# EasyEDA Pro project ESP32 Board.eprj

# Schematic Schematic_ESP32 Board
Board Name: Board1; Create Date: 2026-09-16; Page Name: P1; Project Name: ESP32 Board; Schematic Name: Schematic_ESP32 Board; Update Date: 2026-09-17; Company: EasyEDA.com; Page Size: A4; Version: V1.0
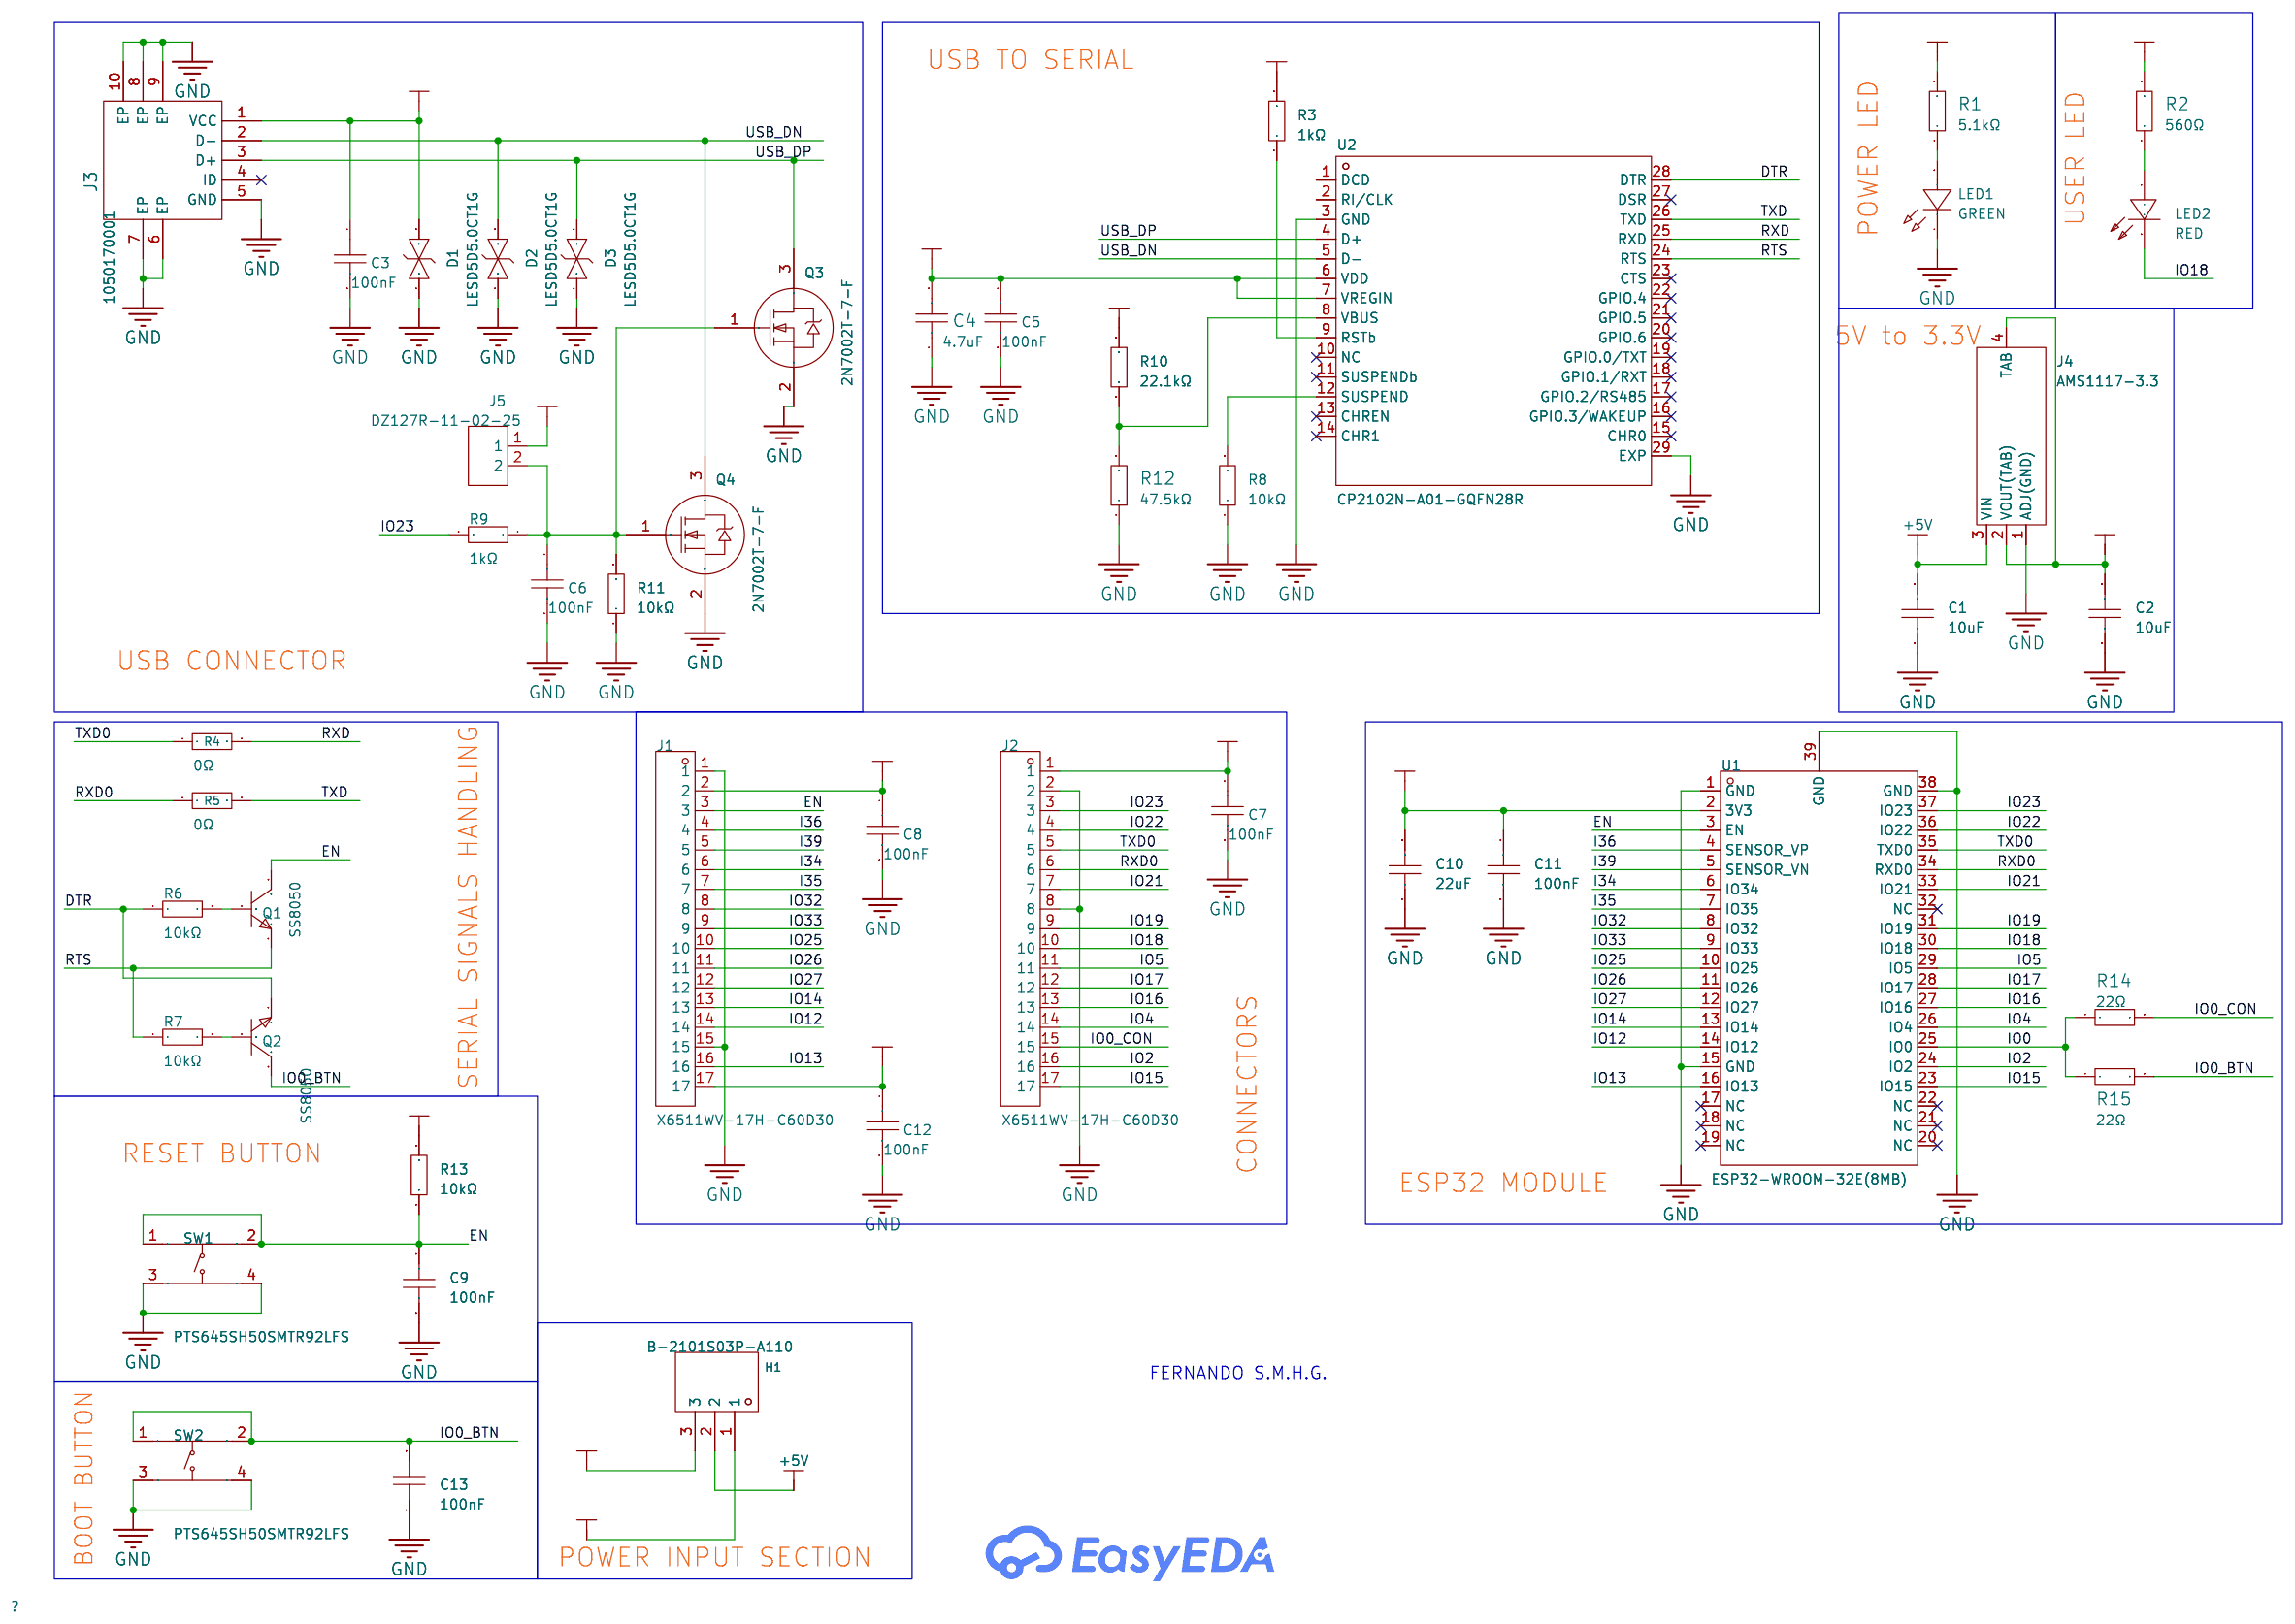
[diagram p0: schematic sheet]

## Parts
C1  10uF  [C0402]
C2  10uF  [C0402]
C3  100nF  [C0402]
C4  4.7uF  [C0402]
C5  100nF  [C0402]
C6  100nF  [C0402]
C7  100nF  [C0402]
C8  100nF  [C0402]
C9  100nF  [C0402]
C10  22uF  [C0805]
C11  100nF  [C0402]
C12  100nF  [C0402]
C13  100nF  [C0402]
D1  LESD5D5.0CT1G  [SOD-523_L1.2-W0.8-LS1.6-BI]
D2  LESD5D5.0CT1G  [SOD-523_L1.2-W0.8-LS1.6-BI]
D3  LESD5D5.0CT1G  [SOD-523_L1.2-W0.8-LS1.6-BI]
H1  B-2101S03P-A110  [HDR-TH_3P-P1.27-V-M-1]
J1  X6511WV-17H-C60D30  [HDR-TH_17P-P2.54-V-M]
J2  X6511WV-17H-C60D30  [HDR-TH_17P-P2.54-V-M]
J3  1050170001  [MICRO-USB-SMD_105017-0001]
J4  AMS1117-3.3  [SOT-223-4_L6.5-W3.5-P2.30-LS7.0-BR]
J5  DZ127R-11-02-25  [HDR-TH_2P-P1.27-V-M]
LED1  GREEN  [LED0805-RD]
LED2  RED  [LED0805-R-RD]
Q1  SS8050  [SOT-23-3_L2.9-W1.3-P1.90-LS2.4-BR]
Q2  SS8050  [SOT-23-3_L2.9-W1.3-P1.90-LS2.4-BR]
Q3  2N7002T-7-F  [SOT-523-3_L1.6-W0.8-P1.00-LS1.6-BR]
Q4  2N7002T-7-F  [SOT-523-3_L1.6-W0.8-P1.00-LS1.6-BR]
R1  5.1kΩ  [R0402]
R2  560Ω  [R0402]
R3  1kΩ  [R0402]
R4  0Ω  [R0402]
R5  0Ω  [R0402]
R6  10kΩ  [R0402]
R7  10kΩ  [R0402]
R8  10kΩ  [R0402]
R9  1kΩ  [R0402]
R10  22.1kΩ  [R0402]
R11  10kΩ  [R0402]
R12  47.5kΩ  [R0402]
R13  10kΩ  [R0402]
R14  22Ω  [R0402]
R15  22Ω  [R0402]
SW1  PTS645SH50SMTR92LFS  [KEY-SMD_4P-L6.0-W6.0-P4.50-LS9.0]
SW2  PTS645SH50SMTR92LFS  [KEY-SMD_4P-L6.0-W6.0-P4.50-LS9.0]
U1  ESP32-WROOM-32E(8MB)  [WIFI-SMD_ESP32-WROOM-32E]
U2  CP2102N-A01-GQFN28R  [QFN-28_L5.0-W5.0-P0.50-BL-EP3.3]

## Library data of the parts
C1 C2 = CL05A106MP5NUNC_C315248: LCSC Part Name: 10uF ±20% 10V; Supplier Part: C315248; Manufacturer: SAMSUNG(三星); Manufacturer Part: CL05A106MP5NUNC; Supplier Footprint: 0402; JLCPCB Part Class: Extended Part; Datasheet: https://item.szlcsc.com/datasheet/CL05A106MP5NUNC/297154.html; Supplier: LCSC; Tolerance: ±20%; Voltage Rating: 10V; Temperature Coefficient: X5R
C3 C5-C9 C11-C13 = CL05B104KO5NNNC: LCSC Part Name: 100nF ±10% 16V; Supplier Part: C1525; Manufacturer: SAMSUNG(三星); Supplier Footprint: 0402; JLCPCB Part Class: Basic Part; Datasheet: https://item.szlcsc.com/datasheet/CL05B104KO5NNNC/1877.html; Supplier: LCSC; Tolerance: ±10%; Voltage Rating: 16V; Temperature Coefficient: X7R
C4 = CL05A475KP5NRNC: LCSC Part Name: 4.7uF ±10% 10V; Supplier Part: C368809; Manufacturer: SAMSUNG(三星); Supplier Footprint: 0402; JLCPCB Part Class: Extended Part; Datasheet: https://item.szlcsc.com/datasheet/CL05A475KP5NRNC/342854.html; Supplier: LCSC; Tolerance: ±10%; Voltage Rating: 10V; Temperature Coefficient: X5R
C10 = CL21A226MAYNNNE: LCSC Part Name: 22uF ±20% 25V; Supplier Part: C602037; Manufacturer: SAMSUNG(三星); Supplier Footprint: 0805; JLCPCB Part Class: Extended Part; Datasheet: https://item.szlcsc.com/datasheet/CL21A226MAYNNNE/631473.html; Supplier: LCSC; Tolerance: ±20%; Voltage Rating: 25V; Temperature Coefficient: X5R
D1-D3 = LESD5D5.0CT1G_C7433850: LCSC Part Name: 采用SOD523塑料封装的单向静电放电（ESD）保护二极管，旨在保护一条传输线或数据线免受ESD和其他瞬态现象造成的损坏。; Supplier Part: C7433850; Manufacturer: KUU; Supplier Footprint: SOD-523; JLCPCB Part Class: Extended Part; Datasheet: https://item.szlcsc.com/datasheet/LESD5D5.0CT1G/8442902.html; Supplier: LCSC; Polarity: Bidirectional; Reverse Stand-Off Voltage (Vrwm): 5V; Clamping Voltage: 15V; Peak Pulse Current (Ipp): 8A; Peak Pulse Power Dissipation (Ppp): 120W; Voltage - Breakdown: 8V; Reverse Leakage Current (Ir): 200nA; Number of Channels: 1; Operating Temperature: -55℃~+125℃; level of protection: IEC 61000-4-2；IEC 61000-4-4; Type: ESD; Junction Capacitance: 20pF
H1 = B-2101S03P-A110: LCSC Part Name: 1x3P 间距:1.27mm 方针 直插; Supplier Part: C124354; Manufacturer: Ckmtw(灿科盟); Supplier Footprint: 插件,P=1.27mm; JLCPCB Part Class: Extended Part; Datasheet: https://item.szlcsc.com/datasheet/B-2101S03P-A110/125629.html; Supplier: LCSC; Pin Structure: 1x3P; Pitch: 1.27mm; Circluar Pins/Square Pins: Pin Header; Mounting Type: Through Hole; Number of Rows: 1; Number of Pins: 3P; Current Rating: 1A; Length of Mating Pin: 3mm; Insulation Height: 1mm; Length of End Connection Pin: 1.8mm; Contact Material: Brass; Contact Plating: Gold; Operating Temperature: -40℃~+105℃; Color: Black
J1 J2 = X6511WV-17H-C60D30: LCSC Part Name: 1x17P 间距:2.54mm 方针; Supplier Part: C725949; Manufacturer: XKB Connection(中国星坤); Supplier Footprint: 插件,P=2.54mm; JLCPCB Part Class: Extended Part; Datasheet: https://item.szlcsc.com/datasheet/X6511WV-17H-C60D30/772398.html; Supplier: LCSC; Pin Structure: 1x17P; Pitch: 2.54mm; Row Spacing: 2.54mm; Circluar Pins/Square Pins: Pin Header; Number of Rows: 1; Number of Pins: 17P; Current Rating: 3A; Voltage Rating (Max): 250V; Insulation Height: 2.5mm; Contact Material: Brass; Contact Plating: Gold; Operating Temperature: -40℃~+105℃; Color: Black
J3 = 1050170001: LCSC Part Name: Micro-B 母 卧贴; Supplier Part: C136000; Manufacturer: MOLEX; Supplier Footprint: SMD; JLCPCB Part Class: Extended Part; Datasheet: https://www.molex.com/content/dam/molex/molex-dot-com/products/automated/en-us/salesdrawingpdf/105/105017/1050171001_sd.pdf?inline; Supplier: LCSC; Connector Type: Micro-B; Protocol Standard: USB 2.0; Gender: Female; Mounting Type: Surface Mount, Right Angle; Number of Contacts: 5P; Number of Ports: 1; Voltage Rating: 30V; Connect-Disconnect Life: 10000 times; Detection color: Black; Operating Temperature: -30℃~+85℃
J4 = AMS1117-3.3_C347222: LCSC Part Name: 3.3V 1A 12V; Supplier Part: C347222; Manufacturer: UMW(友台半导体); Supplier Footprint: SOT-223; JLCPCB Part Class: Extended Part; Datasheet: https://item.szlcsc.com/datasheet/AMS1117-3.3/323882.html; Supplier: LCSC; Output Configuration: Positive; Voltage - Supply: 12V; Output Voltage: 3.3V; Output Current: 1A; Power Supply Rejection Ratio (PSRR): 60dB@(120Hz); Voltage Dropout: 1.3V@(1A); standby current: 5mA; Noise: 0.003%Vout; Features: Over Current Protection; Operating Temperature: -40℃~+125℃; Output Type: Fixed; Number of Outputs: 1
J5 = DZ127R-11-02-25: LCSC Part Name: 1x2P 间距:1.27mm 方针 直插; Supplier Part: C2935942; Manufacturer: DEALON(德艺隆); Supplier Footprint: 插件,P=1.27mm; JLCPCB Part Class: Extended Part; Datasheet: https://item.szlcsc.com/datasheet/DZ127R-11-02-25/3287520.html; Supplier: LCSC; Pin Structure: 1x2P; Pitch: 1.27mm; Circluar Pins/Square Pins: Pin Header; Mounting Type: Through Hole; Number of Rows: 1; Number of Pins: 2P; Current Rating: 1A; Length of Mating Pin: 3mm; Insulation Height: 1mm; Length of End Connection Pin: 2.5mm; Contact Material: Brass; Contact Plating: Gold; Color: Black
LED1 = ZGH-Z2012C-10L-Z3: LCSC Part Name: 翠绿; Supplier Part: C2689226; Manufacturer: Chau Light(洲光源); Supplier Footprint: 0805; JLCPCB Part Class: Extended Part; Supplier: LCSC; Illumination Color: Emerald Green; Voltage - Forward(Vf): 2.75V~3.65V; Power(Watts): 110mW; Forward Current: 20mA; Wavelength - Dominant: 520nm~535nm; Diode Configuration: Discrete Diode; Lens Color: Water Clear; Luminous Intensity: 112mcd~285mcd; Viewing Angle: 140°; Operating Temperature: -40℃~+85℃
LED2 = 17-21VRD/TR8: LCSC Part Name: 停产 红灯; Supplier Part: C264415; Manufacturer: EVERLIGHT(亿光); Supplier Footprint: 0805; JLCPCB Part Class: Extended Part; Supplier: LCSC; Illumination Color: Red; Voltage - Forward(Vf): 2V; Wavelength - Dominant: 625nm; Peak Wavelength: 640nm; Luminous Intensity: 3mcd; Viewing Angle: 150°; Operating Temperature: -40℃~+85℃
Q1 Q2 = SS8050_C51953470: LCSC Part Name: SS8050 hFE:120-400 NPN 晶体管 电流：1.5A 电压：25V; Supplier Part: C51953470; Manufacturer: CCX(晁禾); Supplier Footprint: SOT-23; JLCPCB Part Class: Extended Part; Datasheet: https://item.szlcsc.com/datasheet/SS8050/54682180.html; Supplier: LCSC; type: NPN; Current - Collector(Ic): 1.5A; Collector - Emitter Voltage VCEO: 25V; Pd - Power Dissipation: 300mW; DC Current Gain: 400; Transition frequency(fT): 100MHz; Current - Collector Cutoff: 100nA; Vce Saturation(VCE(sat)): 500mV; Operating Temperature: -55℃~+150℃; Emitter-Base Voltage(Vebo): 5V; Number: 1 NPN; Configuration: Standalone
Q3 Q4 = 2N7002T-7-F: LCSC Part Name: 1个N沟道 耐压:60V 电流:115mA; Supplier Part: C139445; Manufacturer: DIODES(美台); Supplier Footprint: SOT-523; JLCPCB Part Class: Extended Part; Datasheet: https://item.szlcsc.com/datasheet/2N7002T-7-F/150768.html; Supplier: LCSC; Number: 1 N-channel; Drain to Source Voltage: 60V; Current - Continuous Drain(Id): 115mA; RDS(on): 13.5Ω@10V; Pd - Power Dissipation: 150mW; Gate Threshold Voltage (Vgs(th)): 2V; Input Capacitance(Ciss): 50pF; Reverse Transfer Capacitance (Crss@Vds): 5pF; Operating Temperature: -55℃~+150℃; Type: N-Channel; Output Capacitance(Coss): 25pF; Vgs: ±20V
R1 = 0402WGF5101TCE: LCSC Part Name: 厚膜电阻 5.1kΩ ±1%; Supplier Part: C25905; Manufacturer: UNI-ROYAL(厚声); Supplier Footprint: 0402; JLCPCB Part Class: Basic Part; Datasheet: https://item.szlcsc.com/datasheet/0402WGF5101TCE/26648.html; Supplier: LCSC; Type: Thick Film Resistor; Tolerance: ±1%; Power(Watts): 62.5mW; Voltage-Supply(Max): 50V; Temperature Coefficient: ±100ppm/℃; Operating Temperature: -55℃~+155℃
R2 = 0402WGF5600TCE: LCSC Part Name: 厚膜电阻 560Ω ±1%; Supplier Part: C25126; Manufacturer: UNI-ROYAL(厚声); Supplier Footprint: 0402; JLCPCB Part Class: Extended Part; Datasheet: https://item.szlcsc.com/datasheet/0402WGF5600TCE/25869.html; Supplier: LCSC; Type: Thick Film Resistor; Tolerance: ±1%; Power(Watts): 62.5mW; Voltage-Supply(Max): 50V; Temperature Coefficient: ±100ppm/℃; Operating Temperature: -55℃~+155℃
R3 R9 = 0402WGF1001TCE: LCSC Part Name: 厚膜电阻 1kΩ ±1%; Supplier Part: C11702; Manufacturer: UNI-ROYAL(厚声); Supplier Footprint: 0402; JLCPCB Part Class: Basic Part; Datasheet: https://item.szlcsc.com/datasheet/0402WGF1001TCE/12256.html; Supplier: LCSC; Type: Thick Film Resistor; Tolerance: ±1%; Power(Watts): 62.5mW; Voltage-Supply(Max): 50V; Temperature Coefficient: ±100ppm/℃; Operating Temperature: -55℃~+155℃
R4 R5 = 0402WGF0000TCE: LCSC Part Name: 厚膜电阻 0Ω ±1%; Supplier Part: C17168; Manufacturer: UNI-ROYAL(厚声); Supplier Footprint: 0402; JLCPCB Part Class: Basic Part; Datasheet: https://item.szlcsc.com/datasheet/0402WGF0000TCE/17853.html; Supplier: LCSC; Type: Thick Film Resistor; Tolerance: ±1%; Power(Watts): 62.5mW; Voltage-Supply(Max): 50V; Temperature Coefficient: ±800ppm/℃; Operating Temperature: -55℃~+155℃
R6-R8 R11 R13 = 0402WGF1002TCE: LCSC Part Name: 厚膜电阻 10kΩ ±1%; Supplier Part: C25744; Manufacturer: UNI-ROYAL(厚声); Supplier Footprint: 0402; JLCPCB Part Class: Basic Part; Datasheet: https://item.szlcsc.com/datasheet/0402WGF1002TCE/26487.html; Supplier: LCSC; Type: Thick Film Resistor; Tolerance: ±1%; Power(Watts): 62.5mW; Voltage-Supply(Max): 50V; Temperature Coefficient: ±100ppm/℃; Operating Temperature: -55℃~+155℃
R10 = 0402WGF2212TCE: LCSC Part Name: 22.1kΩ ±1% 62.5mW 厚膜电阻; Supplier Part: C43473; Manufacturer: UNI-ROYAL(厚声); Supplier Footprint: 0402; JLCPCB Part Class: Extended Part; Datasheet: https://item.szlcsc.com/datasheet/0402WGF2212TCE/44464.html; Supplier: LCSC; Type: Thick Film Resistor; Tolerance: ±1%; Power(Watts): 62.5mW; Voltage-Supply(Max): 50V; Temperature Coefficient: ±100ppm/℃; Operating Temperature: -55℃~+155℃
R12 = 0402WGF4752TCE: LCSC Part Name: 厚膜电阻 47.5kΩ ±1%; Supplier Part: C25896; Manufacturer: UNI-ROYAL(厚声); Supplier Footprint: 0402; JLCPCB Part Class: Extended Part; Datasheet: https://item.szlcsc.com/datasheet/0402WGF4752TCE/26639.html; Supplier: LCSC; Type: Thick Film Resistor; Tolerance: ±1%; Power(Watts): 62.5mW; Voltage-Supply(Max): 50V; Temperature Coefficient: ±100ppm/℃; Operating Temperature: -55℃~+155℃
R14 R15 = 0402WGF220JTCE: LCSC Part Name: 22Ω ±1% 62.5mW 厚膜电阻; Supplier Part: C25092; Manufacturer: UNI-ROYAL(厚声); Supplier Footprint: 0402; JLCPCB Part Class: Basic Part; Datasheet: https://atta.szlcsc.com/upload/public/pdf/source/20200306/C422600_1E6D84923E4A46A82E41ADD87F860B5C.pdf; Supplier: LCSC; Type: Thick Film Resistors; Tolerance: ±1%; Temperature Coefficient: ±100ppm/℃; Operating Temperature Range: -55℃~+155℃
SW1 SW2 = PTS645SH50SMTR92LFS: LCSC Part Name: 6*6*5mm 立贴 轻触开关; Supplier Part: C221869; Manufacturer: C&K; Supplier Footprint: SMD-4P,6x6mm; JLCPCB Part Class: Extended Part; Datasheet: https://item.szlcsc.com/datasheet/PTS645SH50SMTR92LFS/222299.html; Supplier: LCSC; Circuit: SPST; Actuator Style: Round Button; Operating Force: 2N; Mounting Type: Surface Mount,Vertical; Length: 6mm; Width: 6mm; Switch Height: 5mm; Contact Current: 50mA; Voltage Rating: 12V; Termination Style: Gull Wing; Operating Temperature: -40℃~+85℃
U1 = ESP32-WROOM-32E-N8: LCSC Part Name: 不带固件 通用型Wi-Fi+BT+BLE MCU模组; Supplier Part: C701342; Manufacturer: ESPRESSIF(乐鑫); Supplier Footprint: SMD,25.5x18mm; JLCPCB Part Class: Extended Part; Datasheet: https://item.szlcsc.com/datasheet/ESP32-WROOM-32E-N8/736350.html; Supplier: LCSC; Utilized IC / Part: ESP32-DOWD-V3; Wireless Standard: Bluetooth4.2; Interface Type: I2C；GPIO；UART；SPI；PWM；SDIO；I2S; Antenna Type: On-board PCB Antenna; Output Power: 20dBm; Voltage - Supply: 3V~3.6V; Receive  Current: 112mA; Send  Current: 239mA; Sensitivity: -98dBm; Operating Temperature: -40℃~+85℃
U2 = CP2102N-A01-GQFN28R_C105167: LCSC Part Name: 停产 USB转UART桥接控制器，集成USB收发器和时钟，无需外部电阻和晶体，支持USB 2.0全速，具备电池充电器检测和远程唤醒功能; Supplier Part: C105167; Manufacturer: SKYWORKS/SILICON LABS(芯科); Supplier Footprint: QFN-28-EP(5x5); JLCPCB Part Class: Extended Part; Datasheet: https://item.szlcsc.com/datasheet/CP2102N-A01-GQFN28R/106382.html; Supplier: LCSC; Applications Function: Transceiver; USB Protocol: USB 2.0; Voltage - Supply: 3V~3.6V; Data Rate: 3Mbps; Operating Temperature: -40℃~+85℃; Current - Supply: 13.7mA; Quiescent Supply Current: 195uA; Features: FIFO buffer；Programmable baud rate；Wake-up function；Built-in clock generator；Hardware flow control support；Low-power mode；Power-on reset

## Nets
+3V3: C2.2 C4.2 C5.1 C7.1 C8.1 C10.2 C11.1 J1.2 J2.1 J4.2(VOUT(TAB)) J4.4(TAB) J5.1 R1.2 R2.2 R3.2 R13.2 U1.2(3V3) U2.6(VDD) U2.7(VREGIN)
+5V: C1.2 H1.2 J4.3(VIN)
+5V_EXT: C12.1 H1.3 J1.17
+5V_VBUS: C3.1 D1.2 H1.1 J3.1(VCC) R10.2
GND: C1.1 C2.1 C3.2 C4.1 C5.2 C6.2 C7.2 C8.2 C9.2 C10.1 C11.2 C12.2 C13.1 D1.1 D2.1 D3.1 J1.1 J1.15 J2.2 J2.8 J3.5(GND) J3.6(EP) J3.7(EP) J3.8(EP) J3.9(EP) J3.10(EP) J4.1(ADJ(GND)) LED1.1(K) Q3.2(S) Q4.2(S) R8.1 R11.1 R12.1 SW1.3 SW1.4 SW2.3 SW2.4 U1.1(GND) U1.15(GND) U1.38(GND) U1.39(GND) U2.3(GND) U2.29(EXP)
DTR: Q2.2(E) R6.1 U2.28(DTR)
EN: C9.1 J1.3 Q1.3(C) R13.1 SW1.1 SW1.2 U1.3(EN)
I34: J1.6 U1.6(IO34)
I35: J1.7 U1.7(IO35)
I36: J1.4 U1.4(SENSOR_VP)
I39: J1.5 U1.5(SENSOR_VN)
IO0: R14.1 R15.1 U1.25(IO0)
IO0_BTN: C13.2 Q2.3(C) R15.2 SW2.1 SW2.2
IO0_CON: J2.15 R14.2
IO2: J2.16 U1.24(IO2)
IO4: J2.14 U1.26(IO4)
IO5: J2.11 U1.29(IO5)
IO12: J1.14 U1.14(IO12)
IO13: J1.16 U1.16(IO13)
IO14: J1.13 U1.13(IO14)
IO15: J2.17 U1.23(IO15)
IO16: J2.13 U1.27(IO16)
IO17: J2.12 U1.28(IO17)
IO18: J2.10 LED2.2(K) U1.30(IO18)
IO19: J2.9 U1.31(IO19)
IO21: J2.7 U1.33(IO21)
IO22: J2.4 U1.36(IO22)
IO23: J2.3 R9.2 U1.37(IO23)
IO25: J1.10 U1.10(IO25)
IO26: J1.11 U1.11(IO26)
IO27: J1.12 U1.12(IO27)
IO32: J1.8 U1.8(IO32)
IO33: J1.9 U1.9(IO33)
RTS: Q1.2(E) R7.1 U2.24(RTS)
RXD: R4.2 U2.25(RXD)
RXD0: J2.6 R5.1 U1.34(RXD0)
TXD: R5.2 U2.26(TXD)
TXD0: J2.5 R4.1 U1.35(TXD0)
USB_DN: D2.2 J3.2(D-) Q4.3(D) U2.5(D-)
USB_DP: D3.2 J3.3(D+) Q3.3(D) U2.4(D+)
$1N3216: R8.2 U2.12(SUSPEND)
$1N3226: R10.1 R12.2 U2.8(VBUS)
$1N3703: Q2.1(B) R7.2
$1N3708: Q1.1(B) R6.2
$1N3799: LED1.2(A) R1.1
$1N5228: LED2.1(A) R2.1
$1N6060: R3.1 U2.9(RSTb)
$1N6073: C6.1 J5.2 Q3.1(G) Q4.1(G) R9.1 R11.2

Not connected (* = marked no-connect by the designer): J3 4(ID)*; U1 17(NC)* 18(NC)* 19(NC)* 20(NC)* 21(NC)* 22(NC)* 32(NC)*; U2 1(DCD) 2(RI/CLK) 10(NC)* 11(SUSPENDb)* 13(CHREN)* 14(CHR1)* 15(CHR0)* 16(GPIO.3/WAKEUP)* 17(GPIO.2/RS485)* 18(GPIO.1/RXT)* 19(GPIO.0/TXT)* 20(GPIO.6)* 21(GPIO.5)* 22(GPIO.4)* 23(CTS)* 27(DSR)*

## Notes on the sheet
- USB TO SERIAL
- POWER LED
- USER LED
- 5V to 3.3V
- USB CONNECTOR
- SERIAL SIGNALS HANDLING
- CONNECTORS
- RESET BUTTON
- ESP32 MODULE
- FERNANDO S.M.H.G.
- BOOT BUTTON
- POWER INPUT SECTION

# Board PCB_ESP32 Board
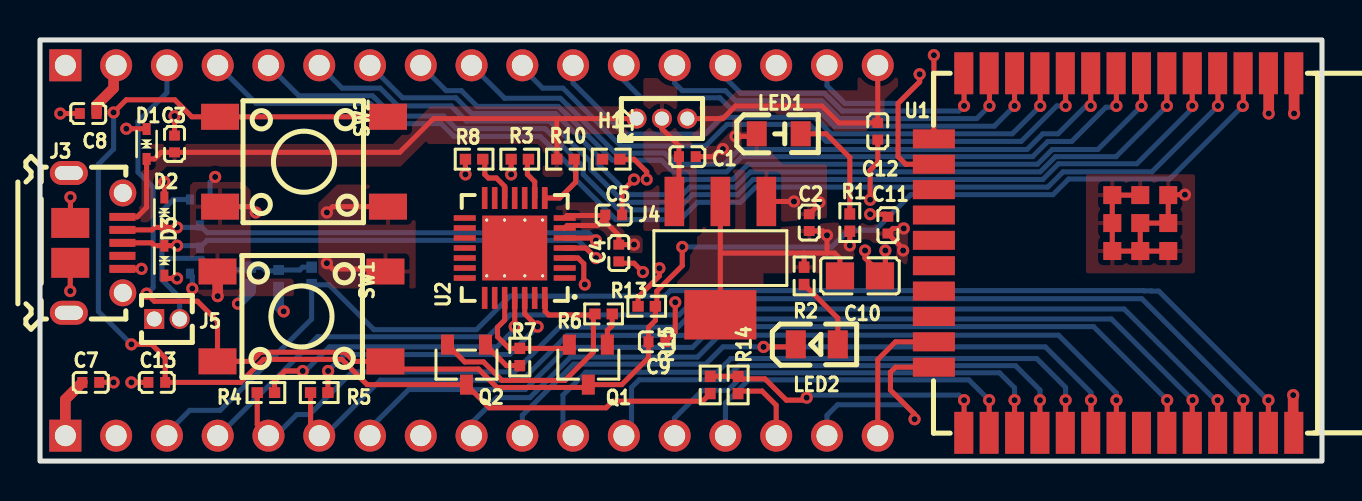
[diagram p1: board, top side]
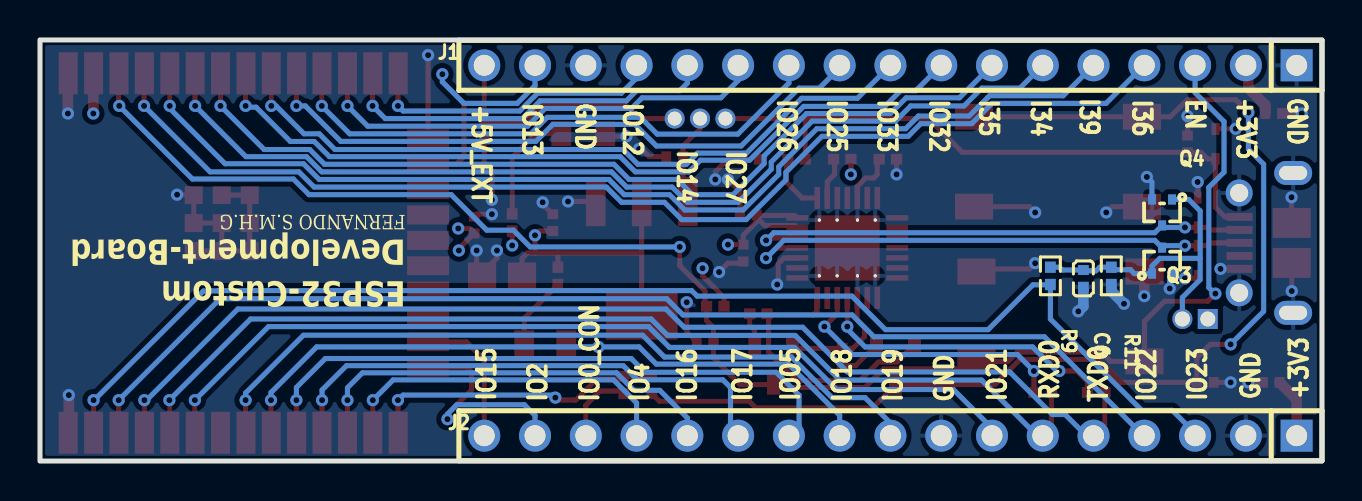
[diagram p2: board, bottom side, seen from below]

Outline 64.13 x 21.08 mm; copper layers: Top Layer, Inner1, Inner2, Bottom Layer. Coordinates in mm from the lower left corner of the outline.
Outline path: rectangle 0,21.08 64.13,0
Stack: Top Layer 0.035mm Outer layer thickness 1oz / Dielectric1 0.2104mm 7628 RC49% 8.6mil / Inner1 0.0152mm Inner layer thickness / Dielectric2 1.065mm 1.1mm H/HOZ Copper / Inner2 0.0152mm Inner layer thickness / Dielectric3 0.2104mm 7628 RC49% 8.6mil / Bottom Layer 0.035mm Outer layer thickness 1oz

## Design rules (mm)
template: JLCPCB Capability(Two Layers Board)
spacing copperThickness1oz (default): track to track 0.102, other pairs 0.152 to 0.3
spacing copperThickness2oz: track to track 0.203, other pairs 0.152 to 0.3
track width copperThickness1oz (default): min 0.127, default 0.254, max 2.54
track width copperThickness2oz: min 0.203, default 0.254, max 2.54
differential pair differentialPair (default): width min 0.127, default 0.254, max 2.54; gap min 0.152, default 0.152
via viaSize (default): diameter min 0.5, default 0.61, max 10; hole min 0.3, default 0.305, max 6.3

## Placement (name value [footprint] x y rotation side)
C1  10uF  [C0402]  32.38 15.24 180 top
C2  10uF  [C0402]  38.48 11.94 270 top
C3  100nF  [C0402]  6.73 15.88 90 top
C4  4.7uF  [C0402]  28.96 10.41 90 top
C5  100nF  [C0402]  28.7 12.32 0 top
C6  100nF  [C0402]  11.94 9.14 270 bottom
C7  100nF  [C0402]  2.54 3.94 0 top
C8  100nF  [C0402]  2.41 17.4 180 top
C9  100nF  [C0402]  30.86 5.97 0 top
C10  22uF  [C0805]  41.02 9.27 180 top
C11  100nF  [C0402]  42.42 11.81 90 top
C12  100nF  [C0402]  41.91 16.51 270 top
C13  100nF  [C0402]  5.84 3.94 0 top
D1  LESD5D5.0CT1G  [SOD-523_L1.2-W0.8-LS1.6-BI]  5.33 15.88 270 top
D2  LESD5D5.0CT1G  [SOD-523_L1.2-W0.8-LS1.6-BI]  6.22 12.45 270 top
D3  LESD5D5.0CT1G  [SOD-523_L1.2-W0.8-LS1.6-BI]  6.22 10.03 90 top
H1  B-2101S03P-A110  [HDR-TH_3P-P1.27-V-M-1]  31.12 17.14 0 top
J1  X6511WV-17H-C60D30  [HDR-TH_17P-P2.54-V-M]  21.59 19.81 0 bottom
J2  X6511WV-17H-C60D30  [HDR-TH_17P-P2.54-V-M]  21.59 1.27 0 bottom
J3  1050170001  [MICRO-USB-SMD_105017-0001]  2.79 10.92 270 top
J4  AMS1117-3.3  [SOT-223-4_L6.5-W3.5-P2.30-LS7.0-BR]  34.04 10.16 90 top
J5  DZ127R-11-02-25  [HDR-TH_2P-P1.27-V-M]  6.35 7.11 0 top
LED1  GREEN  [LED0805-RD]  36.96 16.38 0 top
LED2  RED  [LED0805-R-RD]  38.86 5.84 0 top
NOREF  -  [Pad_e4825]  24.26 9.27 0 top
NOREF#2  -  [Pad_e4826]  22.35 12.06 0 top
NOREF#3  -  [Pad_e4828]  24.26 12.06 0 top
NOREF#4  -  [Pad_e4827]  23.24 12.06 0 top
NOREF#5  -  [Pad_e4823]  23.24 9.27 0 top
NOREF#6  -  [Pad_e4818]  22.35 9.27 0 top
NOREF#7  -  [Pad_e4824]  25.15 9.27 0 top
NOREF#8  -  [Pad_e4829]  25.15 12.06 0 top
Q1  SS8050  [SOT-23-3_L2.9-W1.3-P1.90-LS2.4-BR]  27.43 4.83 90 top
Q2  SS8050  [SOT-23-3_L2.9-W1.3-P1.90-LS2.4-BR]  21.34 4.83 90 top
Q3  2N7002T-7-F  [SOT-523-3_L1.6-W0.8-P1.00-LS1.6-BR]  8 10.03 270 bottom
Q4  2N7002T-7-F  [SOT-523-3_L1.6-W0.8-P1.00-LS1.6-BR]  8 12.45 90 bottom
R1  5.1kΩ  [R0402]  40.51 11.94 270 top
R2  560Ω  [R0402]  38.23 9.27 90 top
R3  1kΩ  [R0402]  24 15.11 180 top
R4  0Ω  [R0402]  11.3 3.43 0 top
R5  0Ω  [R0402]  13.97 3.43 0 top
R6  10kΩ  [R0402]  28.19 7.37 0 top
R7  10kΩ  [R0402]  24 5.21 270 top
R8  10kΩ  [R0402]  21.72 15.11 0 top
R9  1kΩ  [R0402]  13.59 9.27 270 bottom
R10  22.1kΩ  [R0402]  26.29 15.11 180 top
R11  10kΩ  [R0402]  10.54 9.27 90 bottom
R12  47.5kΩ  [R0402]  28.57 15.11 180 top
R13  10kΩ  [R0402]  30.35 7.75 180 top
R14  22Ω  [R0402]  34.93 3.81 270 top
R15  22Ω  [R0402]  33.53 3.81 270 top
SW1  PTS645SH50SMTR92LFS  [KEY-SMD_4P-L6.0-W6.0-P4.50-LS9.0]  13.08 7.24 180 top
SW2  PTS645SH50SMTR92LFS  [KEY-SMD_4P-L6.0-W6.0-P4.50-LS9.0]  13.21 14.99 0 top
U1  ESP32-WROOM-32E(8MB)  [WIFI-SMD_ESP32-WROOM-32E]  53.72 10.41 180 top
U2  CP2102N-A01-GQFN28R  [QFN-28_L5.0-W5.0-P0.50-BL-EP3.3]  23.75 10.67 90 top

## Footprints (pads in the part's own frame, mm; a bottom-side part is the same pattern mirrored in y, then rotated)
C0402
  rect 0.5x0.54 smd: 1(-0.42,0) 2(0.42,0)
C0805
  rect 1.41x1.35 smd: 1(-1,0) 2(1,0)
HDR-TH_2P-P1.27-V-M
  rect 1x1 hole 0.75: 1(-0.635,0)
  round 1 hole 0.75: 2(0.635,0)
HDR-TH_3P-P1.27-V-M-1
  round 1 hole 0.7: 1(-1.27,0) 2(0,0) 3(1.27,0)
HDR-TH_17P-P2.54-V-M
  rect 1.6x1.6 hole 1.05: 1(-20.32,0)
  round 1.6 hole 1.05: 2(-17.78,0) 3(-15.24,0) 4(-12.7,0) 5(-10.16,0) 6(-7.62,0) 7(-5.08,0) 8(-2.54,0) 9(0,0) 10(2.54,0) 11(5.08,0) 12(7.62,0) 13(10.16,0) 14(12.7,0) 15(15.24,0) 16(17.78,0) 17(20.32,0)
KEY-SMD_4P-L6.0-W6.0-P4.50-LS9.0
  rect 1.9x1.3 smd: 1(-4.2,2.25) 2(4.2,2.25) 3(-4.2,-2.25) 4(4.2,-2.25)
LED0805-R-RD
  rect 1x1.399 smd: 1(1.05,0) 2(-1.05,0)
LED0805-RD
  rect 1x1.25 smd: 1(-1.1,0) 2(1.1,0)
MICRO-USB-SMD_105017-0001
  rect 0.4x1.3 smd: 1(-1.3,1.33) 2(-0.65,1.33) 3(0,1.33) 4(0.65,1.33) 5(1.3,1.33)
  round 1.35 hole 0.9: 6(-2.5,1.35) 7(2.5,1.35)
  oval 1.2x1.9 hole 0.7x1.4: 8(3.5,-1.35) 9(-3.5,-1.35)
  rect 1.5x1.9 smd: 10(-1,-1.28) 10(1,-1.28)
Pad_e4818
  round 0.152 hole 1.27x0.508: 1(0,0)
Pad_e4823
  round 0.152 hole 0.508: 1(0,0)
Pad_e4824
  round 0.152 hole 0.508: 1(0,0)
Pad_e4825
  round 0.152 hole 0.508: 1(0,0)
Pad_e4826
  round 0.152 hole 0.508: 1(0,0)
Pad_e4827
  round 0.152 hole 0.508: 1(0,0)
Pad_e4828
  round 0.152 hole 0.508: 1(0,0)
Pad_e4829
  round 0.152 hole 0.508: 1(0,0)
QFN-28_L5.0-W5.0-P0.50-BL-EP3.3
  rect 0.28x1.1 smd: 1(-1.501,-2.5) 2(-1.001,-2.5) 3(-0.5,-2.5) 4(0,-2.5) 5(0.5,-2.5) 6(1,-2.5) 7(1.501,-2.5) 15(1.501,2.5) 16(1,2.5) 17(0.5,2.5) 18(0,2.5) 19(-0.5,2.5) 20(-1.001,2.5) 21(-1.502,2.5)
  rect 1.1x0.28 smd: 8(2.5,-1.502) 9(2.5,-1.001) 10(2.5,-0.5) 11(2.5,0) 12(2.5,0.5) 13(2.5,1) 14(2.5,1.501) 22(-2.5,1.501) 23(-2.5,1) 24(-2.5,0.5) 25(-2.5,0) 26(-2.5,-0.5) 27(-2.5,-1.001) 28(-2.5,-1.502)
  rect 3.25x3.25 smd: 29(0,0)
R0402
  rect 0.566x0.54 smd: 1(-0.433,0) 2(0.433,0)
SOD-523_L1.2-W0.8-LS1.6-BI
  rect 0.6x0.4 smd: 1(-0.75,0) 2(0.75,0)
SOT-23-3_L2.9-W1.3-P1.90-LS2.4-BR
  rect 1x0.65 smd: 1(1,-0.95) 2(1,0.95) 3(-1,0)
SOT-223-4_L6.5-W3.5-P2.30-LS7.0-BR
  rect 2.47x0.98 smd: 1(2.835,-2.3) 2(2.835,0) 3(2.835,2.3)
  rect 2.47x3.6 smd: 4(-2.835,0)
SOT-523-3_L1.6-W0.8-P1.00-LS1.6-BR
  rect 0.51x0.4 smd: 1(0.65,-0.5) 2(0.65,0.5) 3(-0.65,0)
WIFI-SMD_ESP32-WROOM-32E
  rect 0.95x2.1 smd: 1(-9.002,-9) 2(-7.732,-9) 3(-6.463,-9) 4(-5.192,-9) 5(-3.922,-9) 6(-2.652,-9) 7(-1.383,-9) 8(-0.113,-9) 9(1.157,-9) 10(2.428,-9) 11(3.697,-9) 12(4.968,-9) 13(6.237,-9) 14(7.508,-9) 25(7.508,9) 26(6.237,9) 27(4.968,9) 28(3.697,9) 29(2.428,9) 30(1.157,9) 31(-0.113,9) 32(-1.383,9) 33(-2.652,9) 34(-3.922,9) 35(-5.192,9) 36(-6.463,9) 37(-7.732,9) 38(-9.002,9)
  rect 2.1x0.95 smd: 15(9.002,-5.715) 16(9.002,-4.445) 17(9.002,-3.175) 18(9.002,-1.905) 19(9.002,-0.635) 20(9.002,0.635) 21(9.002,1.905) 22(9.002,3.175) 23(9.002,4.445) 24(9.002,5.715)
  rect 0.9x0.9 smd: 39(-2.721,-0.1) 39(-2.721,-1.5) 39(-2.721,-2.9) 39(-1.321,-0.1) 39(-1.321,-1.5) 39(-1.321,-2.9) 39(0.079,-0.1) 39(0.079,-1.5) 39(0.079,-2.9)

## Nets
As in the schematic, except:
GND: C1.1 C2.1 C3.2 C4.1 C5.2 C6.2 C7.2 C8.2 C9.2 C10.1 C11.2 C12.2 C13.1 D1.1 D2.1 D3.1 J1.1 J1.15 J2.2 J2.8 J3.5 J3.6 J3.7 J3.8 J3.9 J3.10 J4.1 LED1.1 NOREF.1 NOREF#2.1 NOREF#3.1 NOREF#4.1 NOREF#5.1 NOREF#6.1 NOREF#7.1 NOREF#8.1 Q3.2 Q4.2 R8.1 R11.1 R12.1 SW1.3 SW1.4 SW2.3 SW2.4 U1.1 U1.15 U1.38 U1.39 U2.3 U2.29

Pads without a net: J3 4; U1 17 18 19 20 21 22 32; U2 1 2 10 11 13 14 15 16 17 18 19 20 21 22 23 27

## Via types
v1: diameter 0.61, hole 0.305, Top Layer to Bottom Layer, 84 vias

## Routing (per net, layer and track width the routed paths; a pad name or vN(x,y) marks a point on that pad's centre or on a via; arc(x,y) is an arc through that point)
+3V3: length 35.8
  Top Layer w0.254: R2.2 38.23,10.41 38.22,10.41 ; 38.22,10.41 39.75,10.41 40.02,10.14 C10.2 ; 38.22,10.41 34.05,10.41 34.04,10.4 ; 34.04,10.4 J4.4 ; 34.04,10.4 34.04,13 ; 3.68,19.69 J1.2 ; 28.28,12.3 26.38,12.3 26.25,12.17 ; R13.2 29.92,8.2 30.99,9.27 v1(30.99,9.65) ; R1.2 v1(40.51,10.8) ; v1(43.18,10.54) 43.18,10.63 C11.1 42.67,11.64 v1(43.21,11.64) ; U1.2 61.47,19.4 ; C2.2 39.16,11.52 v1(39.37,11.3) 39.37,10.42 ; v1(29.72,10.83) C4.2 28.96,11.3 28.32,11.94 28.32,12.23 27.89,11.8 26.38,11.8 U2.6 ; R3.2 v1(23.57,14.35)
  Top Layer w0.533: C7.1 1.27,3.09 J2.1 ; 3.68,19.69 3.68,18.67 2.83,17.82 C8.1 ; 61.47,19.4 v1(61.47,17.4)
+5V: length 4.6
  Top Layer w0.254: H1.2 31.12,16.64 31.97,15.79 C1.2 31.97,13.22 31.74,13
+5V_EXT: length 13
  Top Layer w0.254: H1.3 34.16,17.14 34.8,17.78 39.12,17.78 39.97,16.93 C12.1 J1.17
+5V_VBUS: length 31.3
  Top Layer w0.254: 25.83,17.14 19.69,17.14 18,15.45 C3.1 6.06,15.45 5.73,15.12 D1.2 5.39,15.07 5.33,15.02 5.33,12.7 4.86,12.22 J3.1 ; 25.83,17.14 25.86,17.12 R10.2 ; 25.83,17.14 H1.1
GND: length 65.9
  Top Layer w0.254: v1(41.53,13.08) 41.53,14.57 41.91,14.95 C12.2 ; 32.81,15.24 33.66,15.24 34.04,15.62 v1(34.16,15.62) ; LED1.1 35.73,16.26 v1(34.8,16.26) ; v1(4.32,16.64) 5.32,16.64 D1.1 ; v1(27.26,8.84) 27.21,8.89 27.21,9.88 26.92,10.17 U2.3 ; U1.39 U1.39 U1.39 U1.39 ; v1(41.28,10.54) 41.28,10.16 42.02,9.41 42.02,9.4 42.15,9.27 42.29,9.41 v1(42.29,10.54) ; C3.2 v1(6.73,17.27) ; v1(38.99,12.95) 38.99,12.87 C2.1 ; SW2.3 10.5,12.74 v1(10.8,12.45) ; v1(6.86,9.14) 6.36,9.14 D3.1 ; R8.1 v1(21.28,14.35) ; C11.2 42.29,12.36 v1(41.53,12.36) ; SW2.4 14.64,12.74 v1(14.35,12.45) ; 31.28,5.97 31.78,6.47 v1(31.78,7.95) ; v1(30.16,9.46) 29.72,9.91 29.04,9.91 C4.1 ; v1(14.35,9.91) 14.64,9.62 17.28,9.62 ; U1.39 U1.39 ; U1.39 U1.39 U1.39 U1.39 U1.39 ; U1.38 62.69,1.45 ; v1(29.72,14.1) 29.12,13.5 C5.2 ; 36.34,13 v1(37.72,13) ; J3.5 v1(5.08,9.62) ; U1.1 62.74,19.4 ; 8.88,9.62 8.89,9.61 ; C13.1 v1(4.57,3.94) ; J3.10 v1(1.51,8.51) ; C8.2 v1(1.02,17.4) ; 56.9,13.34 v1(57.28,13.34) ; v1(30.35,14.1) 30.35,14.48 29.72,15.11 R12.1 ; v1(1.52,13.21) 1.52,11.93 J3.10 ; U1.15 v1(44.72,20.32) ; D2.1 v1(6.22,13.97) ; C7.2 v1(3.68,3.94)
  Top Layer w0.533: 62.74,19.4 v1(62.74,17.4) ; 62.69,1.45 v1(62.69,3.3) ; 8.89,9.61 v1(8.89,8.25)
  Bottom Layer w0.254: Q4.2 8.51,13.1 8.51,13.97 v1(8.76,14.22) ; Q3.2 7.62,9.26 v1(7.62,8.64) ; 12.06,8.72 11.94,8.6
  Bottom Layer w0.533: v1(12.19,7.49) 11.94,7.75 11.94,8.6 ; v1(9.91,7.87) 10.54,8.51 R11.1
DTR: length 13.7
  Top Layer w0.254: U2.28 25.27,8.15 25.27,7.49 25.45,7.31 27.66,7.31 27.69,7.29 ; 27.69,7.29 27.69,5.46 26.26,4.04 23.11,4.04 22.19,4.96 21.25,4.96 Q2.2 ; 27.69,7.29 R6.1
EN: length 80.6
  Top Layer w0.254: v1(32.13,10.72) 32.13,9.78 30.86,8.51 30.86,7.82 R13.1 30.79,7.04 30.44,6.69 C9.1 30.44,5.17 29.1,3.83 Q1.3 27.29,3.68 22.86,3.68 21.94,4.61 17.79,4.61 17.28,5.12 ; v1(5.33,8.38) 5.72,8 7.87,8 8.88,6.99 8.88,4.99 10.58,4.99 11.04,5.45 15.25,5.45 15.71,4.99 17.28,4.99 ; 60.2,17.78 60.2,19.4 U1.3
  Bottom Layer w0.254: J1.3 6.35,18.44 4.9,17 4.9,14.47 5.66,13.7 5.66,8.69 5.36,8.38 v1(5.33,8.38) ; v1(60.17,17.78) 56.51,14.12 51.46,14.12 50.67,13.34 43.56,13.34 41.78,11.56 40.45,11.56 39.61,10.72 v1(32.13,10.72)
I34: length 49.1
  Top Layer w0.254: U1.6 v1(56.37,17.78)
  Bottom Layer w0.254: v1(56.37,17.78) 53.83,15.24 50.8,15.24 50.04,14.48 35.55,14.48 34.78,13.72 32.51,13.72 31.75,12.95 29.21,12.95 27.55,14.61 27.55,14.97 25.5,17.02 21.34,17.02 20.57,17.78 17.91,17.78 17.02,18.67 15.11,18.67 J1.6
I35: length 45
  Top Layer w0.254: U1.7 v1(55.1,17.78)
  Bottom Layer w0.254: v1(55.1,17.78) 52.92,15.6 50.64,15.6 49.9,14.86 35.42,14.86 34.66,14.1 32.25,14.1 31.49,13.34 29.46,13.34 27.91,14.89 27.91,15.28 25.79,17.4 21.59,17.4 20.8,18.19 18.14,18.19 J1.7
I36: length 57.5
  Top Layer w0.254: v1(58.93,17.78) 58.93,19.4 U1.4
  Bottom Layer w0.254: v1(58.93,17.78) 55.63,14.48 51.18,14.48 50.42,13.72 35.8,13.72 35.04,12.95 32.89,12.95 32.03,12.09 28.81,12.09 26.82,14.07 26.82,14.45 25.02,16.26 20.71,16.26 20.07,16.89 17.54,16.89 17.51,16.92 17.5,16.92 16.51,17.91 10.8,17.91 8.9,19.81 J1.4
I39: length 53.3
  Top Layer w0.254: U1.5 v1(57.64,17.78)
  Bottom Layer w0.254: J1.5 11.43,19.81 12.95,18.29 16.63,18.29 16.73,18.19 16.74,18.19 17.65,17.27 20.19,17.27 20.83,16.64 25.27,16.64 27.18,14.73 27.18,14.35 28.96,12.57 31.88,12.57 32.64,13.34 34.91,13.34 35.67,14.1 50.16,14.1 50.95,14.88 54.87,14.88 57.64,17.65 v1(57.64,17.78)
IO0: length 15
  Top Layer w0.254: v1(38.35,3.17) 38.23,3.05 37.34,3.05 36.27,4.12 35.05,4.12 R14.1 R15.1 ; U1.25 46.23,1.43 v1(46.23,3.05)
  Bottom Layer w0.254: v1(46.23,3.05) 45.97,3.3 38.48,3.3 v1(38.35,3.17)
IO0_BTN: length 59.2
  Top Layer w0.254: v1(4.57,5.84) 5.59,5.84 6.26,5.17 C13.2 10.03,3.94 11.19,5.09 15.1,5.09 16.37,3.83 Q2.3 21.34,3.81 22.48,2.67 28.32,2.67 28.65,3 33.15,3 R15.2 ; v1(3.68,17.45) 4.32,18.09 6.74,18.09 7.59,17.24 SW2.1 SW2.2
  Bottom Layer w0.254: v1(4.57,5.84) 2.92,7.49 2.92,14.86 3.68,15.62 v1(3.68,17.45)
IO0_CON: length 3.8
  Top Layer w0.254: J2.15 36.83,2.79 36.12,3.5 35.05,3.5 R14.2
IO2: length 11.2
  Top Layer w0.254: U1.24 42.8,4.7 42.54,4.45 42.54,3.56 43.75,2.35 v1(43.75,2.1)
  Bottom Layer w0.254: J2.16 39.37,2.29 39.9,2.82 43.28,2.82 43.75,2.35 v1(43.75,2.1)
IO4: length 17.4
  Top Layer w0.254: U1.26 v1(47.48,3.05)
  Bottom Layer w0.254: J2.14 34.29,2.91 35.44,4.06 46.47,4.06 v1(47.48,3.05)
IO5: length 31
  Top Layer w0.254: U1.29 51.31,1.43 v1(51.31,3.05)
  Bottom Layer w0.254: v1(51.31,3.05) 51.31,3.68 49.86,5.13 34.56,5.13 33.87,4.45 27.31,4.45 26.16,3.3 26.16,1.78 J2.11
IO12: length 15
  Top Layer w0.254: v1(46.23,17.78) 46.23,19.4 U1.14
  Bottom Layer w0.254: v1(46.23,17.78) 45.97,17.53 40.13,17.53 39.24,18.42 35.05,18.42 34.29,19.18 J1.14
IO13: length 13.4
  Top Layer w0.254: v1(44.01,19.37) 44.01,18.99 42.93,17.91 42.93,15.24 43.31,14.86 U1.16
  Bottom Layer w0.254: J1.16 39.37,18.8 40.26,17.91 42.93,17.91 44.01,18.99 v1(44.01,19.37)
IO14: length 19.3
  Top Layer w0.254: U1.13 47.5,19.4 v1(47.5,17.78)
  Bottom Layer w0.254: v1(47.5,17.78) 46.86,17.14 40,17.14 39.12,18.03 34.8,18.03 34.29,18.54 32.13,18.54 31.75,18.92 J1.13
IO15: length 7
  Top Layer w0.254: J2.17 41.91,5.08 42.8,5.97 U1.23
IO16: length 21.4
  Top Layer w0.254: U1.27 v1(48.75,3.05)
  Bottom Layer w0.254: J2.13 31.75,2.16 33.13,3.54 34.42,3.54 35.3,4.42 48,4.42 48.75,3.67 v1(48.75,3.05)
IO17: length 26.1
  Top Layer w0.254: U1.28 v1(50.02,3.05)
  Bottom Layer w0.254: v1(50.02,3.05) 50.02,3.56 48.8,4.78 34.96,4.78 34.25,4.07 29.98,4.07 29.59,3.68 29.59,1.65 J2.12
IO18: length 35.5
  Top Layer w0.254: v1(52.58,3.05) 52.58,1.43 U1.30 ; LED2.2 37.68,5.72 v1(36.19,5.72)
  Bottom Layer w0.254: J2.10 24.13,2.29 26.69,4.85 33.3,4.85 34.16,5.72 v1(36.19,5.72) 50.29,5.72 52.58,3.43 v1(52.58,3.05)
IO19: length 37.9
  Top Layer w0.254: v1(53.85,3.05) 53.85,1.43 U1.31
  Bottom Layer w0.254: J2.9 21.59,1.91 22.86,3.17 24.51,3.17 26.54,5.21 32.89,5.21 33.98,6.3 50.96,6.3 53.85,3.41 v1(53.85,3.05)
IO21: length 45.5
  Top Layer w0.254: v1(56.39,3.05) 56.39,1.43 U1.33
  Bottom Layer w0.254: J2.7 16.51,1.65 18.44,3.58 24.28,3.58 26.39,5.69 32.64,5.69 33.68,6.73 52.71,6.73 v1(56.39,3.05)
IO22: length 57.9
  Top Layer w0.254: v1(60.2,3.05) 60.2,1.43 U1.36
  Bottom Layer w0.254: J2.4 8.94,1.27 13.89,6.22 22.41,6.22 23.51,7.31 31.97,7.31 32.78,8.13 55.12,8.13 v1(60.2,3.05)
IO23: length 65
  Top Layer w0.254: U1.37 v1(61.45,3.05)
  Bottom Layer w0.254: J2.3 6.35,1.4 7.49,2.54 9.02,2.54 13.59,7.11 R9.2 13.6,8.82 14.46,8.82 16.7,6.58 21.84,6.58 23.51,8.25 31.26,8.25 31.54,8.53 55.22,8.53 55.23,8.52 55.59,8.52 55.6,8.51 55.96,8.51 61.44,3.03 v1(61.45,3.05)
IO25: length 32.1
  Top Layer w0.254: U1.10 51.31,19.4 v1(51.31,17.78)
  Bottom Layer w0.254: J1.10 24.13,19.69 25.15,18.67 26.16,18.67 29.06,15.77 33.29,15.77 34.37,16.85 38.48,16.85 39.33,16 49.09,16 50.86,17.78 v1(51.31,17.78)
IO26: length 28.2
  Top Layer w0.254: v1(50.04,17.78) 50.04,19.4 U1.11
  Bottom Layer w0.254: v1(50.04,17.78) 48.64,16.38 39.58,16.38 38.76,17.21 34.1,17.21 33.26,16.37 29.23,16.37 26.67,18.92 J1.11
IO27: length 23.3
  Top Layer w0.254: U1.12 v1(48.75,17.78)
  Bottom Layer w0.254: J1.12 29.21,19.05 30.07,18.19 34.01,18.19 34.54,17.65 38.86,17.65 39.75,16.76 47.74,16.76 v1(48.75,17.78)
IO32: length 40
  Top Layer w0.254: v1(53.85,17.78) 53.85,19.4 U1.8
  Bottom Layer w0.254: J1.8 20.32,18.54 21.08,18.54 21.87,17.75 25.93,17.75 26.26,17.43 26.27,17.43 28.64,15.06 31.09,15.06 31.68,14.48 34.35,14.48 35.11,15.24 49.66,15.24 50.42,16 51.61,16 53.32,17.71 53.78,17.71 v1(53.85,17.78)
IO33: length 35.9
  Top Layer w0.254: U1.9 v1(52.56,17.78)
  Bottom Layer w0.254: v1(52.56,17.78) 52.32,17.78 50.93,16.38 50.16,16.38 49.38,15.6 34.96,15.6 34.23,14.86 31.8,14.86 31.24,15.42 28.79,15.42 26.42,17.78 26.41,17.78 26.03,18.16 23.24,18.16 J1.9
RTS: length 6
  Top Layer w0.254: U2.24 23.25,7.06 22.89,6.7 22.89,6.22 23.47,5.64 R7.1 26.3,5.64 Q1.2
RXD: length 15.2
  Top Layer w0.254: R4.2 11.74,3.99 12.26,4.51 v1(13.14,4.51) ; U2.25 v1(23.75,6.73)
  Bottom Layer w0.254: v1(13.14,4.51) 13.27,4.51 14.48,5.72 22.86,5.72 23.75,6.6 v1(23.75,6.73)
RXD0: length 51.8
  Top Layer w0.254: R5.1 13.54,1.7 J2.6 ; U1.34 57.64,3.05
  Bottom Layer w0.254: J2.6 14.25,1.27 17.03,4.05 24.12,4.05 26.35,6.29 32.74,6.29 33.56,7.11 53.6,7.11 v1(57.66,3.05)
TXD: length 14.2
  Top Layer w0.254: R5.2 14.4,4.5 v1(14.41,4.51) ; v1(24.89,6.73) 24.25,7.37 U2.26
  Bottom Layer w0.254: v1(14.41,4.51) 15.24,5.33 23.5,5.33 v1(24.89,6.73)
TXD0: length 56
  Top Layer w0.254: J2.5 10.87,1.83 R4.1 ; U1.35 v1(58.91,3.05)
  Bottom Layer w0.254: J2.5 11.79,1.27 12.85,2.33 13.44,2.33 13.46,2.35 13.51,2.35 15.62,4.46 23.75,4.46 25.98,6.7 31.91,6.7 32.82,7.61 54.24,7.61 58.8,3.05 v1(58.91,3.05)
USB_DN: length 25.7
  Top Layer w0.254: J3.2 5.6,11.57 5.73,11.7 D2.2 v1(6.86,11.7) ; U2.5 27.69,11.17 v1(27.81,11.05)
  Bottom Layer w0.254: v1(6.86,11.7) 7.9,11.7 Q4.3 8.37,11.43 27.43,11.43 v1(27.81,11.05)
USB_DP: length 26.1
  Top Layer w0.254: v1(27.81,10.16) 27.31,10.67 U2.4 ; J3.3 5.59,10.92 5.73,10.78 D3.2 v1(6.86,10.78)
  Bottom Layer w0.254: v1(27.81,10.16) 26.92,11.05 8.37,11.05 Q3.3 7.9,10.78 v1(6.86,10.78)
$1N3216: length 2.6
  Top Layer w0.254: R8.2 22.25,15.01 22.25,14.35 22.43,14.17 22.83,14.17 23.25,13.75 U2.12
$1N3226: length 3.1
  Top Layer w0.254: R10.1 26.8,15.04 26.8,13.97 26,13.17 U2.8
$1N3703: length 2.2
  Top Layer w0.254: R7.2 23.34,4.77 Q2.1
$1N3708: length 1.6
  Top Layer w0.254: R6.2 28.63,6.78 28.38,6.54 Q1.1
$1N3799: length 5.8
  Top Layer w0.254: R1.1 40.51,15.2 39.33,16.38 LED1.2
$1N5228: length 3.7
  Top Layer w0.254: R2.1 39.91,7.15 LED2.1
$1N6060: length 2.1
  Top Layer w0.254: R3.1 24.38,15.06 24.38,14.35 24.75,13.98 U2.9
$1N6073: length 15.7
  Bottom Layer w0.254: R9.1 13.13,9.7 12.99,9.56 12.06,9.56 12.03,9.53 11.3,9.53 11.12,9.7 R11.2 10.41,9.58 9.58,9.58 9.4,9.4 9.39,9.4 9.38,9.38 Q3.1 8.5,9.76 8.12,10.15 6.1,10.15 6.1,12.52 6.67,13.1 Q4.1 ; J5.2 6.98,8.19 6.1,9.08 6.1,10.11

## Copper pours and planes (outline as drawn; the poured copper is in the pictures)
+3V3 on Top Layer: 30.15,10.41 30.15,11.12 29.97,11.3 29.44,11.3 28.7,12.04 28.7,12.7 28.45,12.95 26.03,12.95 25.53,12.45 25.53,11.55 25.65,11.43 28.07,11.43 28.19,11.3 28.19,10.41
+3V3 on Top Layer: 31.88,5.72 36.19,5.72 36.19,9.4 39.18,9.4 39.18,8.33 39.11,8.25 41.02,8.25 41.02,11.05 42.29,10.81 43.35,9.73 43.77,11.94 39.62,11.94 35.31,11.56 35.31,14.45 35.16,14.6 32.86,14.6 32.86,10.8 31.88,9.89
+3V3 on Inner1: 0.26,20.83 63.75,20.83 63.75,0.26 0.26,0.26
+5V on Top Layer: 32.86,11.52 32.86,15.74 31.88,16.51 31.88,19.18 30.19,19.18 30.19,11.52
+5V_EXT on Top Layer: 40.89,20.7 42.93,20.7 42.93,18.77 42.25,18.09 42.25,16.51 39.58,16.51 38.75,17.34 34.48,17.34 33.4,16.26 31.86,16.26 31.75,16.37 31.75,17.78 34.1,17.78 34.88,18.56 40.87,18.56 40.89,18.54
+5V_VBUS on Top Layer: 3.17,12.7 4.95,12.7 5.08,12.83 5.08,15.63 4.83,15.88 17.65,15.88 19.53,17.75 30.48,17.75 30.48,16.39 30.5,16.37 26.23,16.37 26.19,16.33 26.19,14.38 26.03,14.22 25.27,14.22 25.15,14.35 25.15,15.62 24.89,15.88 19.43,15.88 19.3,16 18.03,14.73 6.33,14.73 5.66,14.06 5.66,12.21 5.33,11.88 3.19,11.88 3.17,11.9
GND on Top Layer: 18.8,13.84 18.8,8.64 14.66,8.64 13.92,9.38 13.92,12.91 14.86,13.84
GND on Top Layer: 10.54,9.14 10.54,13.56 10.13,13.97 7.67,13.97 7.5,13.8 7.5,9.23 7.87,8.86 7.87,8.25 12.7,8.25 12.7,9.02 12.57,9.14
GND on Top Layer: 32.45,15.77 33.81,15.77 34.64,16.61 34.64,17.21 36.65,17.21 36.65,15.37 37.16,14.86 39.3,14.86 39.37,14.79 39.37,11.94 37.3,11.94 37.05,11.68 35.94,11.68 35.81,11.56 35.81,14.47 35.42,14.86 32.44,14.86 32.44,15.76
GND on Top Layer: 52.32,14.35 57.78,14.35 57.78,9.4 52.32,9.4
GND on Bottom Layer: -2.03,22.48 65.41,22.48 65.41,-1.27 -2.03,-1.27
GND on Inner2: 0.26,20.83 63.75,20.83 63.75,0.26 0.26,0.26

Small or netless copper shapes (teardrops, artwork), in the pictures only: 10 on Inner1, 27 on Inner2

## Text on the board
Bottom Silkscreen Layer: GND | +3V3 | EN | I36 | I39 | I34 | I35 | IO32 | IO33 | IO25 | IO26 | IO27 | IO14 | IO12 | IO13 | +5V_EXT | IO23 | IO22 | TXD0 | RXD0 | IO21 | IO19 | IO18 | IO05 | IO17 | IO16 | IO4 | IO0_CON | IO2 | IO15 | ESP32-Custom / Development-Board | FERNANDO S.M.H.G
